# Altium schematic sheet LPDDR$_SDRAM_1.SchDoc
size A3; SheetNumber: 1; SheetTotal: 6
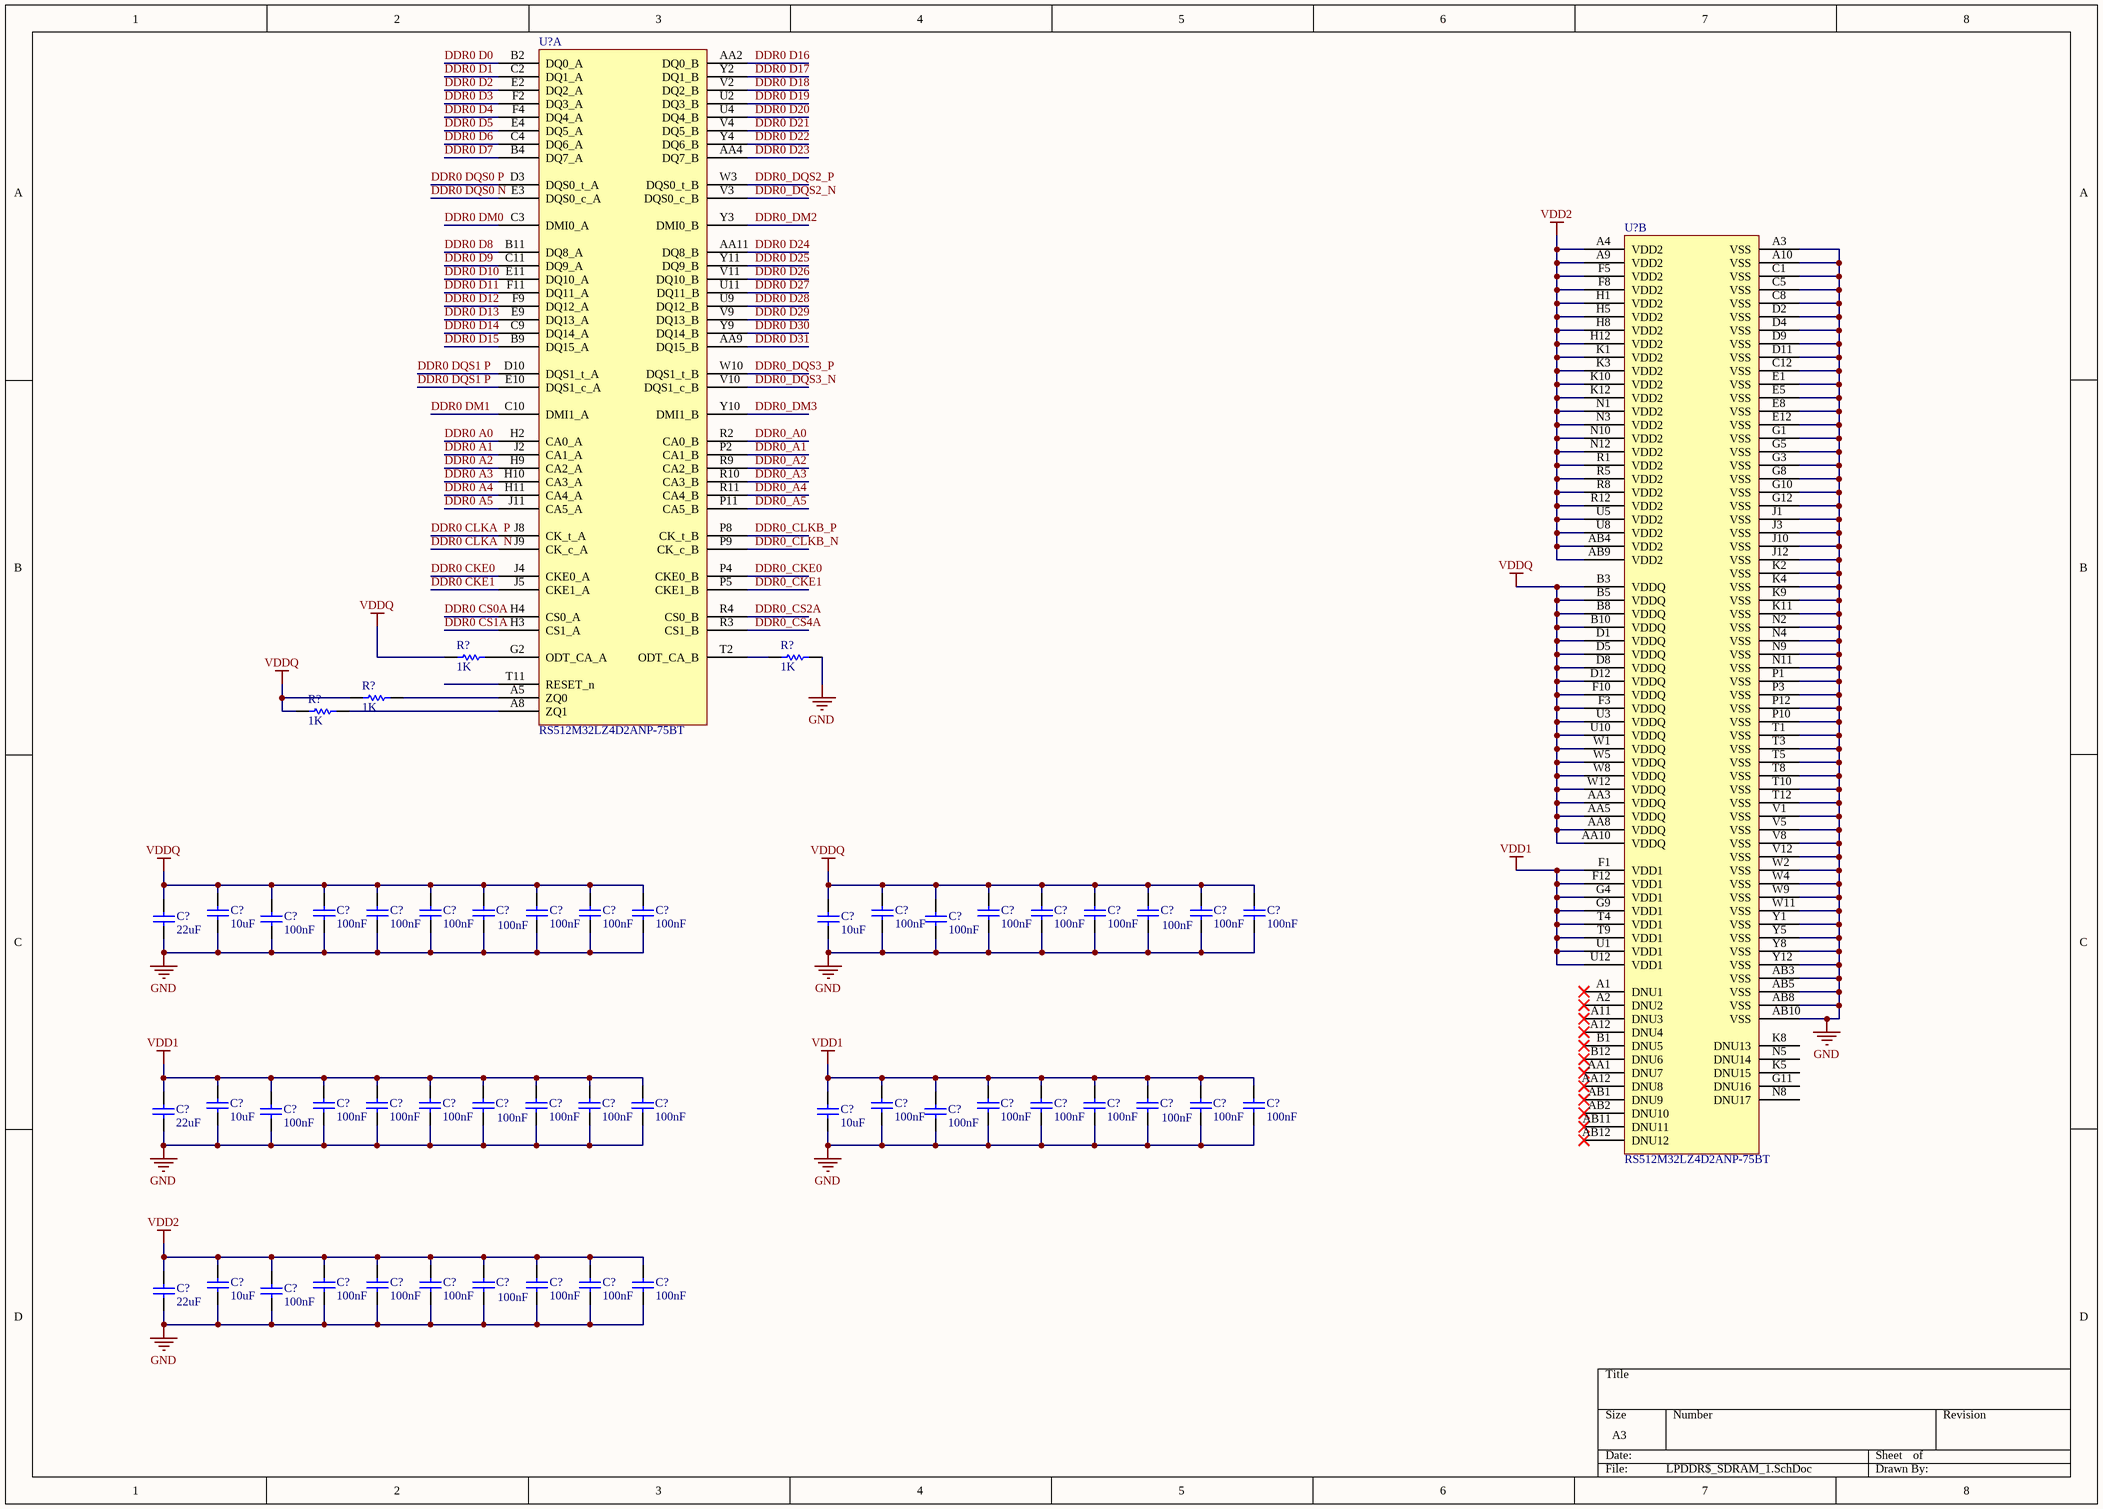
[diagram p0: LPDDR$_SDRAM_1.SchDoc]

## Parts
(Parts that share a designator on the sheet are numbered #1, #2 ... from top to bottom, then left to right.)
C?#1  value 10uF  (hidden comment: Capacitor)
C?#2  value 100nF  (hidden comment: Capacitor)
C?#3  value 100nF  (hidden comment: Capacitor)
C?#4  value 100nF  (hidden comment: Capacitor)
C?#5  value 100nF  (hidden comment: Capacitor)
C?#6  value 100nF  (hidden comment: Capacitor)
C?#7  value 100nF  (hidden comment: Capacitor)
C?#8  value 100nF  (hidden comment: Capacitor)
C?#9  value 100nF  (hidden comment: Capacitor)
C?#10  value 100nF  (hidden comment: Capacitor)
C?#11  value 100nF  (hidden comment: Capacitor)
C?#12  value 100nF  (hidden comment: Capacitor)
C?#13  value 100nF  (hidden comment: Capacitor)
C?#14  value 100nF  (hidden comment: Capacitor)
C?#15  value 100nF  (hidden comment: Capacitor)
C?#16  value 22uF  (hidden comment: Capacitor)
C?#17  value 100nF  (hidden comment: Capacitor)
C?#18  value 10uF  (hidden comment: Capacitor)
C?#19  value 100nF  (hidden comment: Capacitor)
C?#20  value 10uF  (hidden comment: Capacitor)
C?#21  value 100nF  (hidden comment: Capacitor)
C?#22  value 100nF  (hidden comment: Capacitor)
C?#23  value 100nF  (hidden comment: Capacitor)
C?#24  value 100nF  (hidden comment: Capacitor)
C?#25  value 100nF  (hidden comment: Capacitor)
C?#26  value 100nF  (hidden comment: Capacitor)
C?#27  value 100nF  (hidden comment: Capacitor)
C?#28  value 100nF  (hidden comment: Capacitor)
C?#29  value 100nF  (hidden comment: Capacitor)
C?#30  value 100nF  (hidden comment: Capacitor)
C?#31  value 100nF  (hidden comment: Capacitor)
C?#32  value 100nF  (hidden comment: Capacitor)
C?#33  value 100nF  (hidden comment: Capacitor)
C?#34  value 100nF  (hidden comment: Capacitor)
C?#35  value 22uF  (hidden comment: Capacitor)
C?#36  value 100nF  (hidden comment: Capacitor)
C?#37  value 10uF  (hidden comment: Capacitor)
C?#38  value 100nF  (hidden comment: Capacitor)
C?#39  value 22uF  (hidden comment: Capacitor)
C?#40  value 10uF  (hidden comment: Capacitor)
C?#41  value 100nF  (hidden comment: Capacitor)
C?#42  value 100nF  (hidden comment: Capacitor)
C?#43  value 100nF  (hidden comment: Capacitor)
C?#44  value 100nF  (hidden comment: Capacitor)
C?#45  value 100nF  (hidden comment: Capacitor)
C?#46  value 100nF  (hidden comment: Capacitor)
C?#47  value 100nF  (hidden comment: Capacitor)
C?#48  value 100nF  (hidden comment: Capacitor)
R?#1  value 1K  (hidden comment: Resistor)
R?#2  value 1K  (hidden comment: Resistor)
R?#3  value 1K  (hidden comment: Resistor)
R?#4  value 1K  (hidden comment: Resistor)
U?#1  RS512M32LZ4D2ANP-75BT  [FBGA200_SMD]  (part A of 2)
U?#2  RS512M32LZ4D2ANP-75BT  [FBGA200_SMD]  (part B of 2)

## Nets
GND: C?#1.1 C?#2.1 C?#3.1 C?#4.1 C?#5.1 C?#6.1 C?#7.1 C?#8.1 C?#9.1 C?#10.1 C?#11.1 C?#12.1 C?#13.1 C?#14.1 C?#15.1 C?#16.1 C?#17.1 C?#18.1 C?#19.1 C?#20.1 C?#21.1 C?#22.1 C?#23.1 C?#24.1 C?#25.1 C?#26.1 C?#27.1 C?#28.1 C?#29.1 C?#30.1 C?#31.1 C?#32.1 C?#33.1 C?#34.1 C?#35.1 C?#36.1 C?#37.1 C?#38.1 C?#39.1 C?#40.1 C?#41.1 C?#42.1 C?#43.1 C?#44.1 C?#45.1 C?#46.1 C?#47.1 C?#48.1 R?#2.2 U?#2.A3(VSS) U?#2.A10(VSS) U?#2.AB3(VSS) U?#2.AB5(VSS) U?#2.AB8(VSS) U?#2.AB10(VSS) U?#2.C1(VSS) U?#2.C5(VSS) U?#2.C8(VSS) U?#2.C12(VSS) U?#2.D2(VSS) U?#2.D4(VSS) U?#2.D9(VSS) U?#2.D11(VSS) U?#2.E1(VSS) U?#2.E5(VSS) U?#2.E8(VSS) U?#2.E12(VSS) U?#2.G1(VSS) U?#2.G3(VSS) U?#2.G5(VSS) U?#2.G8(VSS) U?#2.G10(VSS) U?#2.G12(VSS) U?#2.J1(VSS) U?#2.J3(VSS) U?#2.J10(VSS) U?#2.J12(VSS) U?#2.K2(VSS) U?#2.K4(VSS) U?#2.K9(VSS) U?#2.K11(VSS) U?#2.N2(VSS) U?#2.N4(VSS) U?#2.N9(VSS) U?#2.N11(VSS) U?#2.P1(VSS) U?#2.P3(VSS) U?#2.P10(VSS) U?#2.P12(VSS) U?#2.T1(VSS) U?#2.T3(VSS) U?#2.T5(VSS) U?#2.T8(VSS) U?#2.T10(VSS) U?#2.T12(VSS) U?#2.V1(VSS) U?#2.V5(VSS) U?#2.V8(VSS) U?#2.V12(VSS) U?#2.W2(VSS) U?#2.W4(VSS) U?#2.W9(VSS) U?#2.W11(VSS) U?#2.Y1(VSS) U?#2.Y5(VSS) U?#2.Y8(VSS) U?#2.Y12(VSS)
VDD1: C?#20.2 C?#21.2 C?#22.2 C?#23.2 C?#24.2 C?#25.2 C?#26.2 C?#27.2 C?#28.2 C?#29.2 C?#30.2 C?#31.2 C?#32.2 C?#33.2 C?#34.2 C?#35.2 C?#36.2 C?#37.2 C?#38.2 U?#2.F1(VDD1) U?#2.F12(VDD1) U?#2.G4(VDD1) U?#2.G9(VDD1) U?#2.T4(VDD1) U?#2.T9(VDD1) U?#2.U1(VDD1) U?#2.U12(VDD1)
VDD2: C?#39.2 C?#40.2 C?#41.2 C?#42.2 C?#43.2 C?#44.2 C?#45.2 C?#46.2 C?#47.2 C?#48.2 U?#2.A4(VDD2) U?#2.A9(VDD2) U?#2.AB4(VDD2) U?#2.AB9(VDD2) U?#2.F5(VDD2) U?#2.F8(VDD2) U?#2.H1(VDD2) U?#2.H5(VDD2) U?#2.H8(VDD2) U?#2.H12(VDD2) U?#2.K1(VDD2) U?#2.K3(VDD2) U?#2.K10(VDD2) U?#2.K12(VDD2) U?#2.N1(VDD2) U?#2.N3(VDD2) U?#2.N10(VDD2) U?#2.N12(VDD2) U?#2.R1(VDD2) U?#2.R5(VDD2) U?#2.R8(VDD2) U?#2.R12(VDD2) U?#2.U5(VDD2) U?#2.U8(VDD2)
VDDQ: C?#1.2 C?#2.2 C?#3.2 C?#4.2 C?#5.2 C?#6.2 C?#7.2 C?#8.2 C?#9.2 C?#10.2 C?#11.2 C?#12.2 C?#13.2 C?#14.2 C?#15.2 C?#16.2 C?#17.2 C?#18.2 C?#19.2 R?#1.1 R?#3.1 R?#4.1 U?#2.AA3(VDDQ) U?#2.AA5(VDDQ) U?#2.AA8(VDDQ) U?#2.AA10(VDDQ) U?#2.B3(VDDQ) U?#2.B5(VDDQ) U?#2.B8(VDDQ) U?#2.B10(VDDQ) U?#2.D1(VDDQ) U?#2.D5(VDDQ) U?#2.D8(VDDQ) U?#2.D12(VDDQ) U?#2.F3(VDDQ) U?#2.F10(VDDQ) U?#2.U3(VDDQ) U?#2.U10(VDDQ) U?#2.W1(VDDQ) U?#2.W5(VDDQ) U?#2.W8(VDDQ) U?#2.W12(VDDQ)
DDR0 A0: U?#1.H2(CA0_A)
DDR0 A1: U?#1.J2(CA1_A)
DDR0 A2: U?#1.H9(CA2_A)
DDR0 A3: U?#1.H10(CA3_A)
DDR0 A4: U?#1.H11(CA4_A)
DDR0 A5: U?#1.J11(CA5_A)
DDR0 CKE0: U?#1.J4(CKE0_A)
DDR0 CKE1: U?#1.J5(CKE1_A)
DDR0 CLKA  N: U?#1.J9(CK_c_A)
DDR0 CLKA  P: U?#1.J8(CK_t_A)
DDR0 CS0A: U?#1.H4(CS0_A)
DDR0 CS1A: U?#1.H3(CS1_A)
DDR0 D0: U?#1.B2(DQ0_A)
DDR0 D1: U?#1.C2(DQ1_A)
DDR0 D2: U?#1.E2(DQ2_A)
DDR0 D3: U?#1.F2(DQ3_A)
DDR0 D4: U?#1.F4(DQ4_A)
DDR0 D5: U?#1.E4(DQ5_A)
DDR0 D6: U?#1.C4(DQ6_A)
DDR0 D7: U?#1.B4(DQ7_A)
DDR0 D8: U?#1.B11(DQ8_A)
DDR0 D9: U?#1.C11(DQ9_A)
DDR0 D10: U?#1.E11(DQ10_A)
DDR0 D11: U?#1.F11(DQ11_A)
DDR0 D12: U?#1.F9(DQ12_A)
DDR0 D13: U?#1.E9(DQ13_A)
DDR0 D14: U?#1.C9(DQ14_A)
DDR0 D15: U?#1.B9(DQ15_A)
DDR0 D16: U?#1.AA2(DQ0_B)
DDR0 D17: U?#1.Y2(DQ1_B)
DDR0 D18: U?#1.V2(DQ2_B)
DDR0 D19: U?#1.U2(DQ3_B)
DDR0 D20: U?#1.U4(DQ4_B)
DDR0 D21: U?#1.V4(DQ5_B)
DDR0 D22: U?#1.Y4(DQ6_B)
DDR0 D23: U?#1.AA4(DQ7_B)
DDR0 D24: U?#1.AA11(DQ8_B)
DDR0 D25: U?#1.Y11(DQ9_B)
DDR0 D26: U?#1.V11(DQ10_B)
DDR0 D27: U?#1.U11(DQ11_B)
DDR0 D28: U?#1.U9(DQ12_B)
DDR0 D29: U?#1.V9(DQ13_B)
DDR0 D30: U?#1.Y9(DQ14_B)
DDR0 D31: U?#1.AA9(DQ15_B)
DDR0 DM0: U?#1.C3(DMI0_A)
DDR0 DM1: U?#1.C10(DMI1_A)
DDR0 DQS0 N: U?#1.E3(DQS0_c_A)
DDR0 DQS0 P: U?#1.D3(DQS0_t_A)
DDR0 DQS1 P: U?#1.D10(DQS1_t_A) U?#1.E10(DQS1_c_A)
DDR0_A0: U?#1.R2(CA0_B)
DDR0_A1: U?#1.P2(CA1_B)
DDR0_A2: U?#1.R9(CA2_B)
DDR0_A3: U?#1.R10(CA3_B)
DDR0_A4: U?#1.R11(CA4_B)
DDR0_A5: U?#1.P11(CA5_B)
DDR0_CKE0: U?#1.P4(CKE0_B)
DDR0_CKE1: U?#1.P5(CKE1_B)
DDR0_CLKB_N: U?#1.P9(CK_c_B)
DDR0_CLKB_P: U?#1.P8(CK_t_B)
DDR0_CS2A: U?#1.R4(CS0_B)
DDR0_CS4A: U?#1.R3(CS1_B)
DDR0_DM2: U?#1.Y3(DMI0_B)
DDR0_DM3: U?#1.Y10(DMI1_B)
DDR0_DQS2_N: U?#1.V3(DQS0_c_B)
DDR0_DQS2_P: U?#1.W3(DQS0_t_B)
DDR0_DQS3_N: U?#1.V10(DQS1_c_B)
DDR0_DQS3_P: U?#1.W10(DQS1_t_B)
NetR?#1_2: R?#1.2 U?#1.G2(ODT_CA_A)
NetR?#2_1: R?#2.1 U?#1.T2(ODT_CA_B)
NetR?#3_2: R?#3.2 U?#1.A5(ZQ0)
NetR?#4_2: R?#4.2 U?#1.A8(ZQ1)

Not connected (* = marked no-connect by the designer): U?#1 T11(RESET_n); U?#2 A1(DNU1)* A2(DNU2)* A11(DNU3)* A12(DNU4)* AA1(DNU7)* AA12(DNU8)* AB1(DNU9)* AB2(DNU10)* AB11(DNU11)* AB12(DNU12)* B1(DNU5)* B12(DNU6)* G11(DNU16) K5(DNU15) K8(DNU13) N5(DNU14) N8(DNU17)

## Library data of the parts
C?#1-C?#48 = Capacitor: SimulationGenericComponent: True
R?#1-R?#4 = Resistor: TC1: 0; SimulationGenericComponent: True; TC2: 0
U?#1 U?#2 = IC_RS512M32LZ4D2ANP-75BT: LPDDR4/4X Package FBGA 200b Density 4Gbit~64Gbit Operating Temperature Range：-25~85℃ Speed：2667Mbps/3200Mbps/3733Mbps Voltage：VDD1/VDD2/VDDQ= 1.8 / 1.1 / 1.1 V（LPDDR4）VDD1/VDD2/VDDQ = 1.8 / 1.1 / 0.6 V（LPDDR4X）Approved Verification Platform：MTK、Spreadtrum; Manufacturer: RAYSON; Manufacturer Part Number: RS512M32LZ4D2ANP-75BT; Case/Package: FBGA 200b; Supplier-1: RAYSON